# EAGLE design USBSocket_Type10_v1.0 (EAGLE 9.6.2)
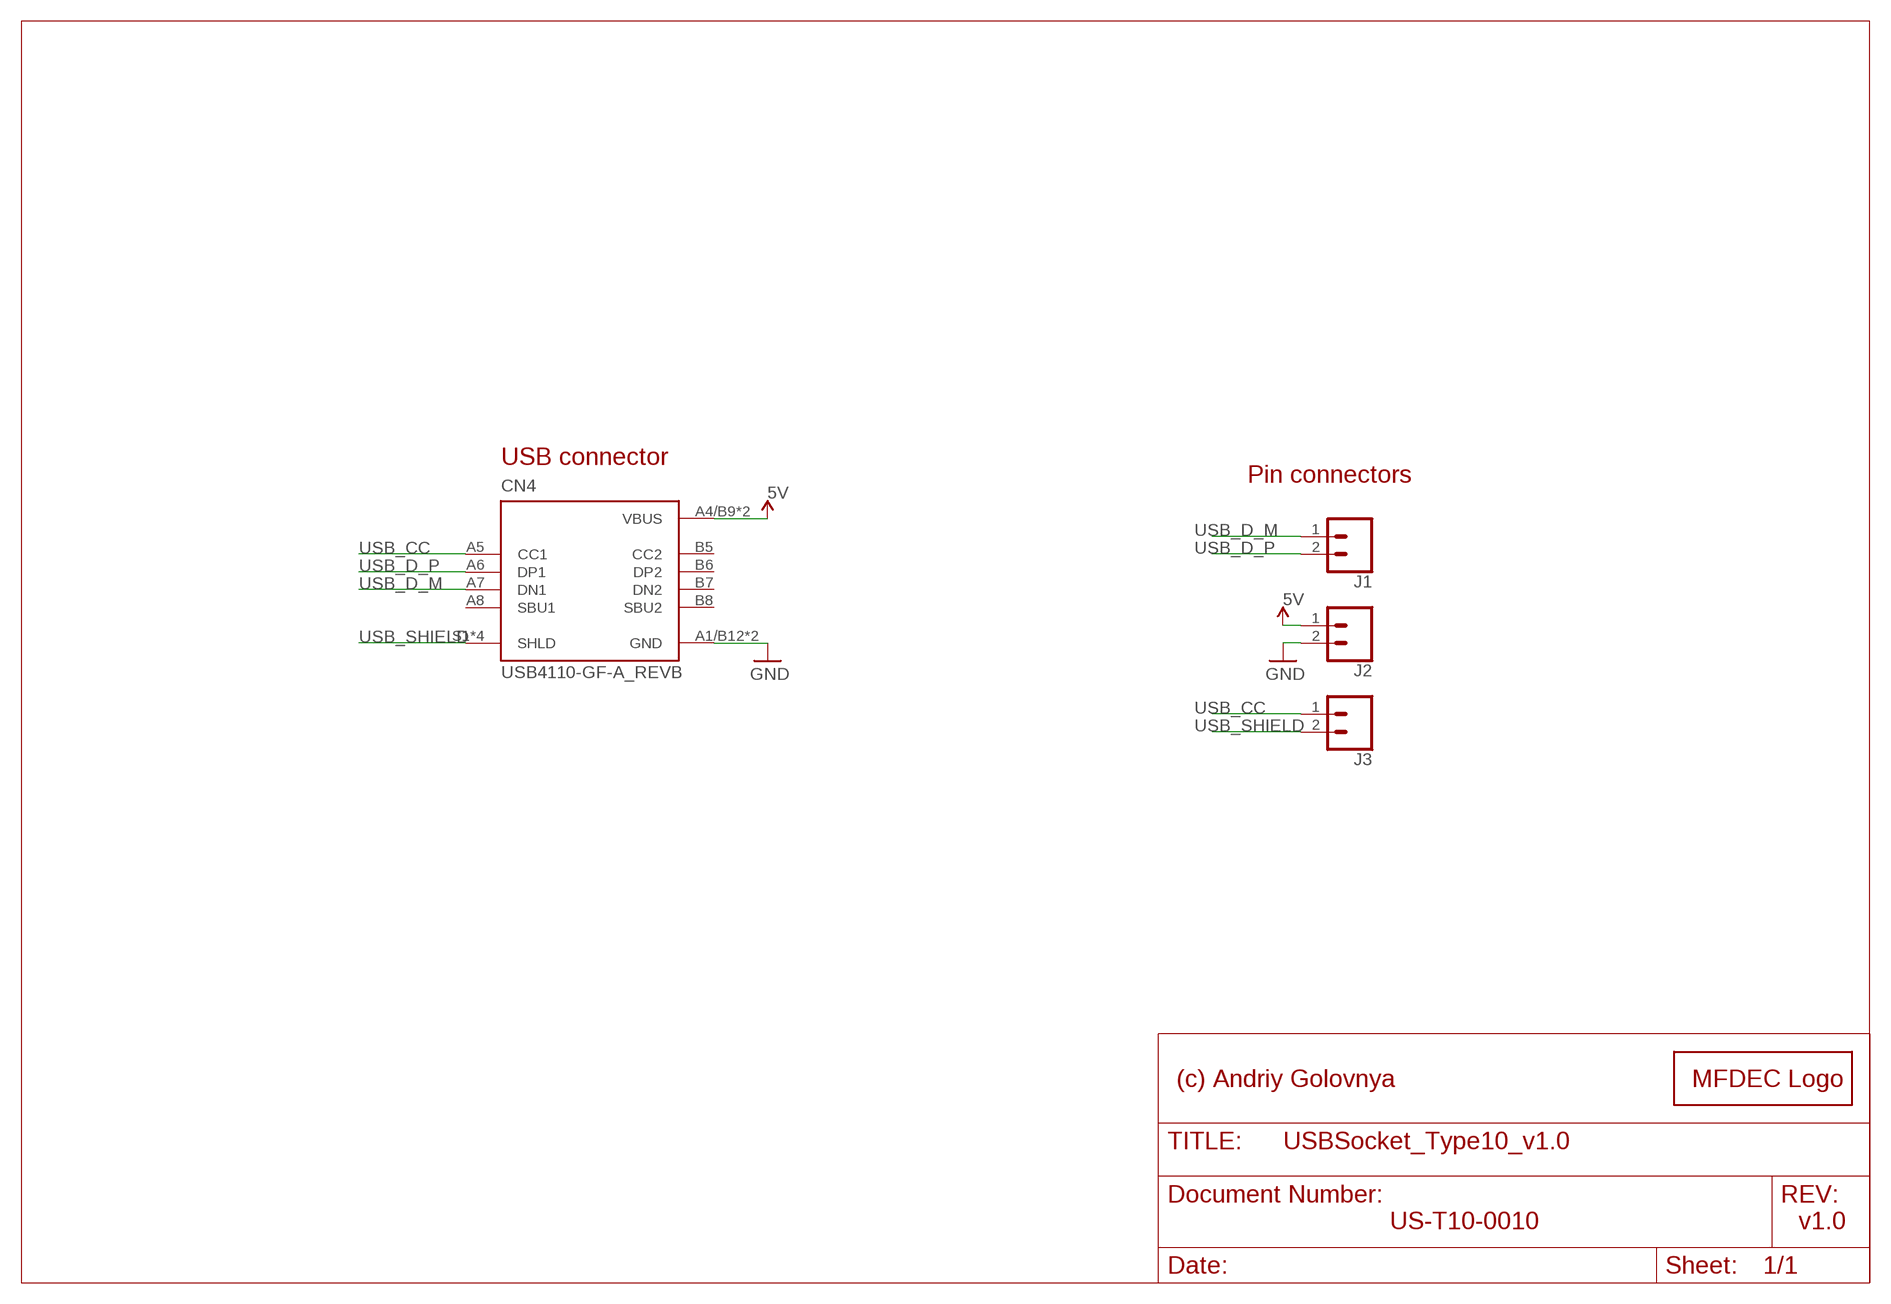
[diagram p0: schematic, sheet 1]

## Parts
CN4  USB4110-GF-A_REVB  [GCT_USB4110-GF-A_REVB]
J1  CONN_02  [1X02]
J2  CONN_02  [1X02]
J3  CONN_02  [1X02]
LOGO1  MFDECLOGO_L_10MM  [MFDEC_L_10MM]

## Nets
5V [POWER]: CN4.A4/B9(VBUS) CN4.B4/A9(VBUS) J2.1
GND [POWER]: CN4.A1/B12(GND) CN4.B1/A12(GND) J2.2
USB_CC: CN4.A5(CC1) J3.1
USB_D_M [XUSB]: CN4.A7(DN1) J1.1
USB_D_P [XUSB]: CN4.A6(DP1) J1.2
USB_SHIELD: CN4.S1(SHLD) CN4.S2(SHLD) CN4.S3(SHLD) CN4.S4(SHLD) J3.2
Unconnected: CN4.A8(SBU1) CN4.B5(CC2) CN4.B6(DP2) CN4.B7(DN2) CN4.B8(SBU2)

## Notes on the sheet
- USB connector
- Pin connectors
- (c) Andriy Golovnya
- US-T10-0010 | v1.0

## Library data of the parts
CN4 = USB4110-GF-A_REVB:USB4110-GF-A_REVB: Check availability <https://pricing.snapeda.com/parts/USB4110-GF-A/GCT/view-part?ref=eda>; AVAILABILITY: In Stock; DESCRIPTION: USB-C (USB TYPE-C) USB 2.0 Receptacle Connector 24 (16+8 Dummy) Position Surface Mount, Right Angle; Through Hole; MF: GCT; MP: USB4110-GF-A; PACKAGE: None; PRICE: None; PURCHASE-URL: https://pricing.snapeda.com/search/part/USB4110-GF-A/?ref=eda
J1-J3 = SparkFun-Connectors:CONN_02: Multi connection point. Often used as Generic Header-pin footprint for 0.1 inch spaced/style header connections On any of the 0.1 inch spaced packages, you can populate with these: Break Away Headers - Straight <https://www.sparkfun.com/products/116> (PRT-00116) Break Away Male Headers - Right Angle <https://www.sparkfun.com/products/553> (PRT-00553) Female Headers <https://www.sparkfun.com/products/115> (PRT-00115) Break Away Headers - Machine Pin <https://www.sparkfun.com/products/117> (PRT-00117) Break Away Female Headers - Swiss Machine Pin <https://www.sparkfun.com/products/743> (PRT-00743) For SCREWTERMINALS and SPRING TERMINALS visit here: Screw Terimnals on SparkFun.com <https://www.sparkfun.com/search/results?term=Screw+Terminals> (5mm/3.5mm/2.54mm spacing) This device is also useful as a general connection point to wire up your design to another part of your project. Our various solder wires solder well into these plated through hole pads. Hook-Up Wire - Assortment (Stranded, 22 AWG) <https://www.sparkfun.com/products/11375> (PRT-11375) Hook-Up Wire - Assortment (Solid Core, 22 AWG) <https://www.sparkfun.com/products/11367> (PRT-11367) View the entire wire category on our website here <https://www.sparkfun.com/categories/141> Special notes: Molex polarized connector foot print use with: PRT-08233 with associated crimp pins and housings. 2.54_SCREWTERM for use with PRT-10571. 3.5mm Screw Terminal footprints for PRT-08084 5mm Screw Terminal footprints for use with PRT-08432
LOGO1 = _my_logos:MFDECLOGO: Midnight Fog - Digital Eye Candy LOGO

## Net classes
1 XUSB: width 0.305 mm
2 USB: width 0.305 mm
3 POWER: width 0.305 mm

## Board
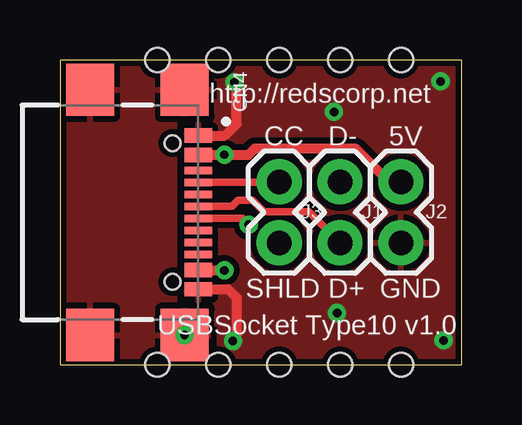
[diagram p1: board, top side]
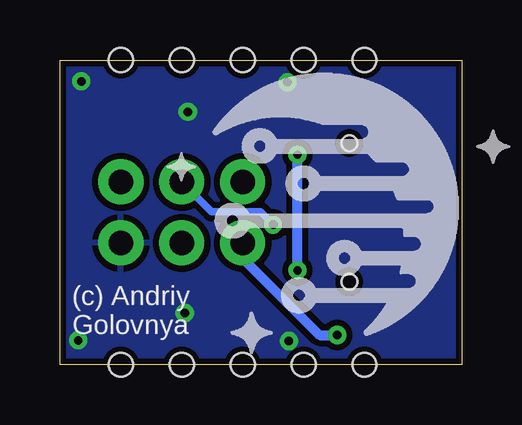
[diagram p2: board, bottom side, seen from below]

Size 16.76 x 12.7 mm. Coordinates in mm from the lower left corner, seen from the top.
Outline: 0,0 16.76,0 16.76,12.7 0,12.7 0,0
Copper layers (1*16): Top 0.035mm / dielectric 1.5mm / Bottom 0.035mm
Design rules "default *": minimum track width 6mil, minimum drill 0.35mm, track to track 6mil, track to pad 6mil, pad to pad 6mil, via to via 6mil, smd to smd 6mil, copper to edge 10mil, drill to drill 6mil, minimum pad ring 10mil, minimum via ring 8mil, stop-mask expansion 4mil, vias tented up to drill 20mil, thermal gap 10mil
Holes 1 mm at 14.22,0 11.68,0 9.14,0 6.6,0 4.06,0 4.06,12.7 6.6,12.7 9.14,12.7 11.68,12.7 14.22,12.7

### Footprints (pad centres in the part's own frame; a part is rotated, then mirrored left to right if it is on the bottom)
GCT_USB4110-GF-A_REVB = smd 0.6 x 1.15: A1/B12 -3.2,1.075; A4/B9 -2.4,1.075; B1/A12 3.2,1.075; B4/A9 2.4,1.075 | smd 0.3 x 1.15: A5 -1.25,1.075; A6 -0.25,1.075; A7 0.25,1.075; A8 1.25,1.075; B5 1.75,1.075; B6 0.75,1.075; B7 -0.75,1.075; B8 -1.75,1.075 | smd 2.18 x 2: S1 -5.11,0.5; S2 5.11,0.5; S3 -5.11,-3.43; S4 5.11,-3.43 | hole 0.65: -2.89,0; 2.89,0
1X02 = drill 1.016 pad 1.88: 1 0,0; 2 2.54,0

### Placement (x,y rotation side)
CN4  4.7,6.35 270 top
J1  11.68,7.62 270 top
J2  14.22,7.62 270 top
J3  9.14,7.62 270 top
LOGO1  -2.79,13.08 180 bottom

### Tracks (layer width: path | path; a pad name or v marks a point on that pad's centre or on a via)
5V  (via drill 0.35)
  Top 0.406: CN4.A4/B9 v6.86,8.75 7.86,8.75 8.13,9.02 12.32,9.02 13.72,7.62 J2.1 | CN4.B4/A9 6.84,3.95 v6.86,3.94
  Bottom 0.406: v6.86,3.94 v6.86,8.75
GND  (via drill 0.35)
  Top 0.406: CN4.A1/B12 6.88,9.55 7.37,10.03 7.37,11.68 v7.28,11.77 | CN4.B1/A12 7.01,3.15 7.37,2.79 7.37,1.14 v7.21,0.99
  other vias: 16,1.02 15.88,11.81 11.56,2.16 11.43,10.54
  pour Top (isolate 0.254, rank 2): 0,0 22.86,0 22.86,12.7 0,12.7
  pour Bottom (isolate 0.254, rank 2): 0,0 19.68,0 19.68,12.7 0,12.7
USB_CC
  Top 0.305: CN4.A5 9.08,7.6 9.1,7.62 J3.1
USB_D_M  (via drill 0.35)
  Top 0.305: CN4.A7 7.62,6.1 v7.87,5.84
  Bottom 0.305: v7.87,5.84 8.41,6.38 10.44,6.38 J1.1
USB_D_P
  Top 0.305: CN4.A6 7.17,6.6 7.42,6.85 8.02,6.85 8.5,6.38 10.39,6.38 J1.2
USB_SHIELD  (via drill 0.35)
  Bottom 0.406: J3.2 9.14,4.45 5.94,1.24 CN4.S2
  other vias: 5.2,1.24
  pour Top (isolate 0.254): 4.83,10.41 6.22,10.41 6.22,12.7 0,12.7 0,0 6.22,0 6.22,2.29 4.83,2.29

### Text on the board
tPlace: http://redscorp.net | CC | D- | 5V | SHLD | D+ | GND | USBSocket Type10 v1.0
bPlace: (c) Andriy / Golovnya